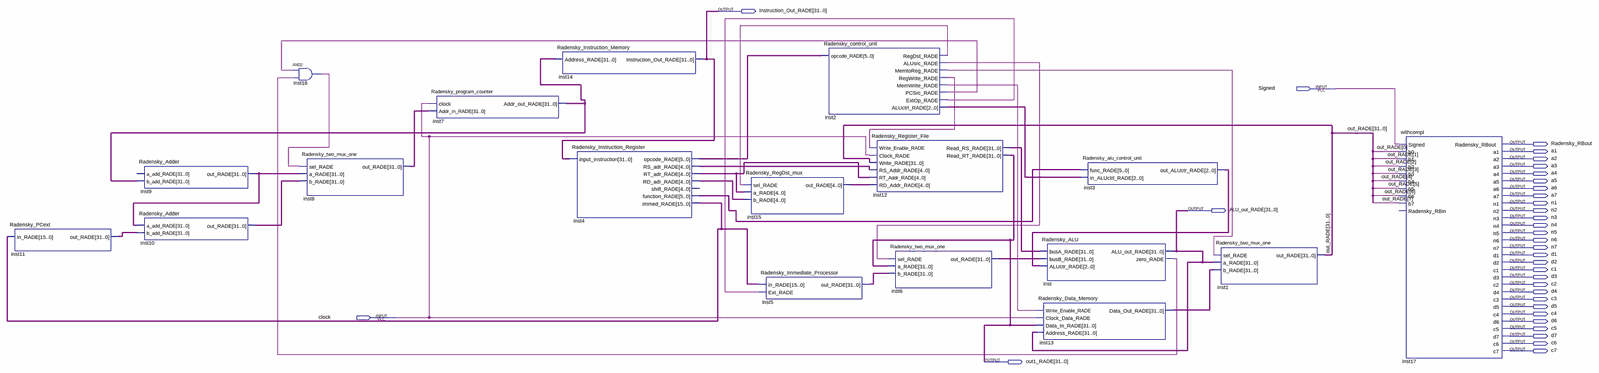
[diagram p0: schematic sheet, whole]
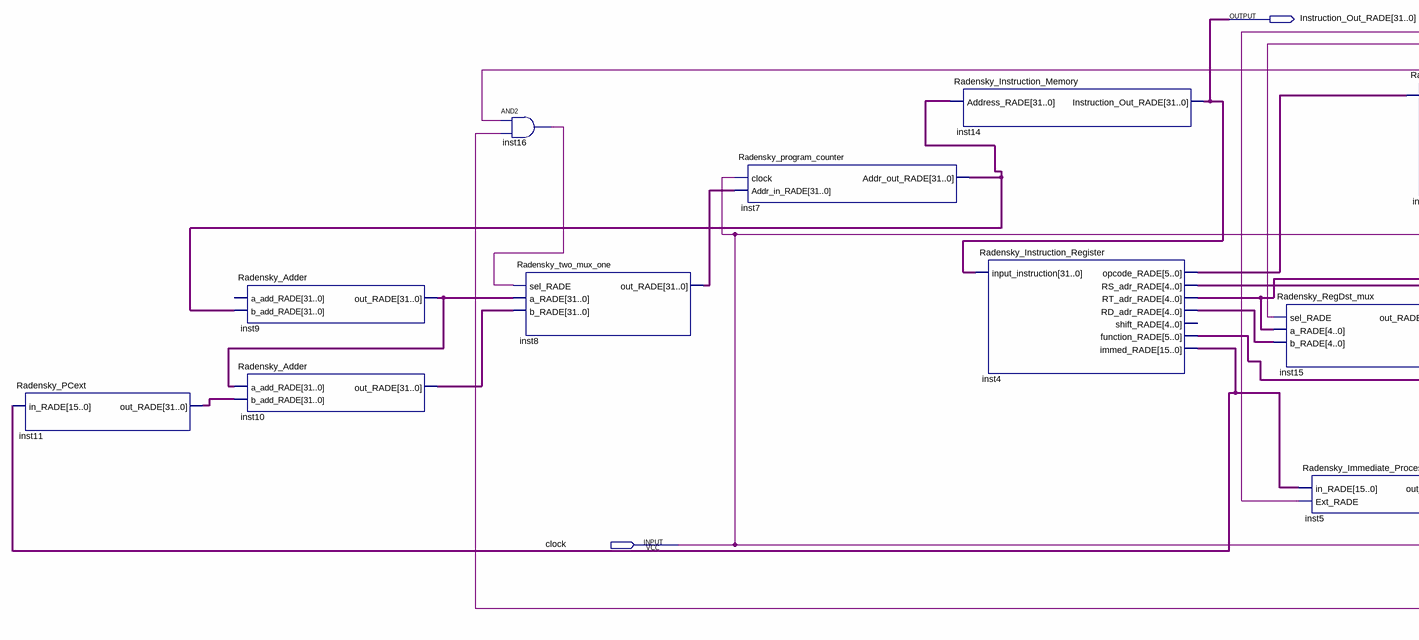
[diagram p1: schematic sheet, left part]
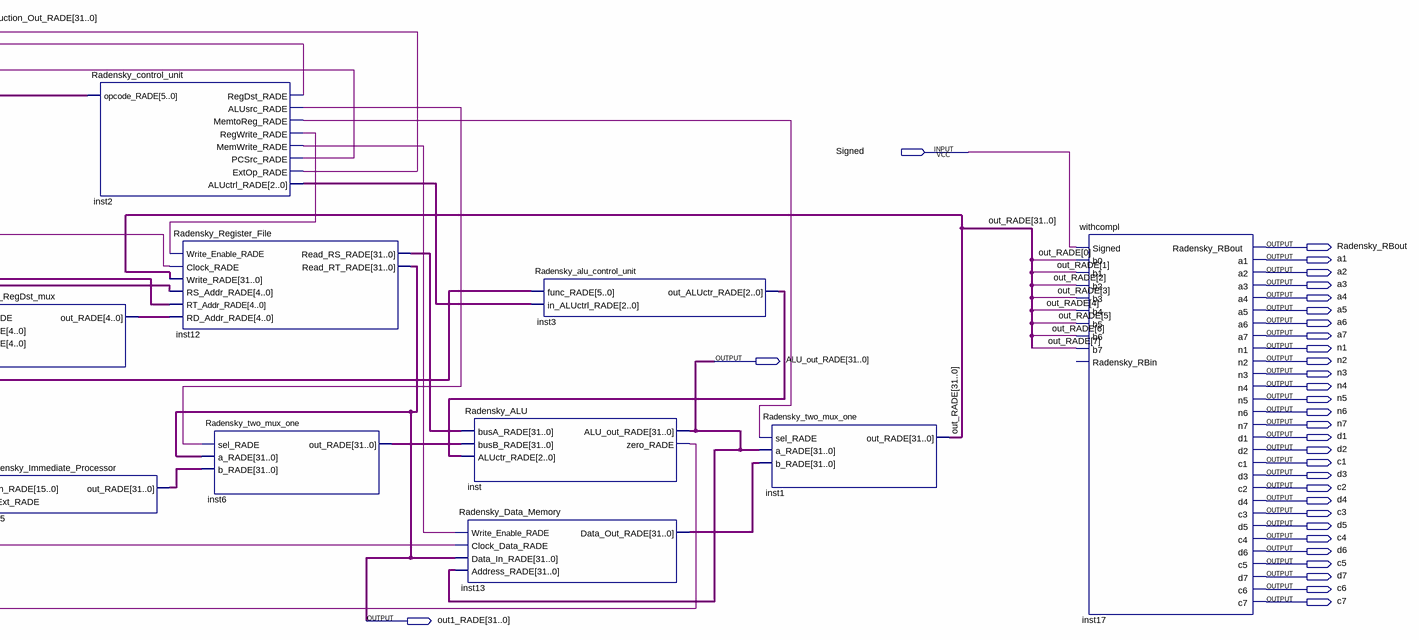
[diagram p2: schematic sheet, right part]
// Quartus schematic Radensky_Single_Cycle_CPU.bdf as structural Verilog: 18 symbols, 34 pins
module Radensky_Single_Cycle_CPU (
  input  Signed,
  input  clock,
  output [31:0] Instruction_Out_RADE,
  output Radensky_RBout,
  output a1,
  output a2,
  output a3,
  output a4,
  output a5,
  output a6,
  output a7,
  output n1,
  output [31:0] ALU_out_RADE,
  output n2,
  output n3,
  output n4,
  output n5,
  output n6,
  output n7,
  output d1,
  output d2,
  output c1,
  output d3,
  output c2,
  output d4,
  output c3,
  output d5,
  output c4,
  output d6,
  output c5,
  output d7,
  output c6,
  output c7,
  output [31:0] out1_RADE
);

  wire inst2_alusrc_rade, inst2_extop_rade, inst2_memtoreg_rade, inst2_memwrite_rade, inst2_pcsrc_rade,
       inst2_regdst_rade, inst2_regwrite_rade, inst16_out, inst_zero_rade;
  wire [2:0] inst2_aluctrl_rade, inst3_out_aluctr_rade;
  wire [4:0] inst4_rd_adr_rade, inst4_rs_adr_rade, inst4_rt_adr_rade, inst15_out_rade;
  wire [5:0] inst4_function_rade, inst4_opcode_rade;
  wire [15:0] inst4_immed_rade;
  wire [31:0] inst5_out_rade, inst6_out_rade, inst7_addr_out_rade, inst8_out_rade, inst9_out_rade,
       inst10_out_rade, inst11_out_rade, inst12_read_rs_rade, inst13_data_out_rade, out_RADE;

  Radensky_PCext inst11 (.in_RADE(inst4_immed_rade), .out_RADE(inst11_out_rade));
  Radensky_Adder inst9 (.b_add_RADE(inst7_addr_out_rade), .out_RADE(inst9_out_rade));  // open: a_add_RADE
  Radensky_Adder inst10 (.a_add_RADE(inst9_out_rade), .b_add_RADE(inst11_out_rade), .out_RADE(inst10_out_rade));
  and inst16 (inst16_out, inst2_pcsrc_rade, inst_zero_rade);
  Radensky_two_mux_one inst8 (
    .sel_RADE(inst16_out), .a_RADE(inst9_out_rade), .b_RADE(inst10_out_rade), .out_RADE(inst8_out_rade));
  Radensky_program_counter inst7 (.clock(clock), .Addr_in_RADE(inst8_out_rade), .Addr_out_RADE(inst7_addr_out_rade));
  Radensky_Instruction_Memory inst14 (.Address_RADE(inst7_addr_out_rade), .Instruction_Out_RADE(Instruction_Out_RADE));
  Radensky_Instruction_Register inst4 (
    .input_instruction(Instruction_Out_RADE), .opcode_RADE(inst4_opcode_rade),
    .RS_adr_RADE(inst4_rs_adr_rade), .RT_adr_RADE(inst4_rt_adr_rade), .RD_adr_RADE(inst4_rd_adr_rade),
    .function_RADE(inst4_function_rade), .immed_RADE(inst4_immed_rade));  // open: shift_RADE
  Radensky_RegDst_mux inst15 (
    .sel_RADE(inst2_regdst_rade), .a_RADE(inst4_rt_adr_rade), .b_RADE(inst4_rd_adr_rade),
    .out_RADE(inst15_out_rade));
  Radensky_Immediate_Processor inst5 (
    .in_RADE(inst4_immed_rade), .Ext_RADE(inst2_extop_rade), .out_RADE(inst5_out_rade));
  Radensky_control_unit inst2 (
    .opcode_RADE(inst4_opcode_rade), .RegDst_RADE(inst2_regdst_rade), .ALUsrc_RADE(inst2_alusrc_rade),
    .MemtoReg_RADE(inst2_memtoreg_rade), .RegWrite_RADE(inst2_regwrite_rade),
    .MemWrite_RADE(inst2_memwrite_rade), .PCSrc_RADE(inst2_pcsrc_rade), .ExtOp_RADE(inst2_extop_rade),
    .ALUctrl_RADE(inst2_aluctrl_rade));
  Radensky_Register_File inst12 (
    .Write_Enable_RADE(inst2_regwrite_rade), .Clock_RADE(clock), .Write_RADE(out_RADE),
    .RS_Addr_RADE(inst4_rs_adr_rade), .RT_Addr_RADE(inst4_rt_adr_rade), .RD_Addr_RADE(inst15_out_rade),
    .Read_RS_RADE(inst12_read_rs_rade), .Read_RT_RADE(out1_RADE));
  Radensky_two_mux_one inst6 (
    .sel_RADE(inst2_alusrc_rade), .a_RADE(out1_RADE), .b_RADE(inst5_out_rade), .out_RADE(inst6_out_rade));
  Radensky_Data_Memory inst13 (
    .Write_Enable_RADE(inst2_memwrite_rade), .Clock_Data_RADE(clock), .Data_In_RADE(out1_RADE),
    .Address_RADE(ALU_out_RADE), .Data_Out_RADE(inst13_data_out_rade));
  Radensky_ALU inst (
    .busA_RADE(inst12_read_rs_rade), .busB_RADE(inst6_out_rade), .ALUctr_RADE(inst3_out_aluctr_rade),
    .ALU_out_RADE(ALU_out_RADE), .zero_RADE(inst_zero_rade));
  Radensky_alu_control_unit inst3 (
    .func_RADE(inst4_function_rade), .in_ALUctrl_RADE(inst2_aluctrl_rade),
    .out_ALUctr_RADE(inst3_out_aluctr_rade));
  Radensky_two_mux_one inst1 (
    .sel_RADE(inst2_memtoreg_rade), .a_RADE(ALU_out_RADE), .b_RADE(inst13_data_out_rade), .out_RADE(out_RADE));
  withcompl inst17 (
    .Signed(Signed), .b0(out_RADE[0]), .b1(out_RADE[1]), .b2(out_RADE[2]), .b3(out_RADE[3]),
    .b4(out_RADE[4]), .b5(out_RADE[5]), .b6(out_RADE[6]), .b7(out_RADE[7]), .Radensky_RBout(Radensky_RBout),
    .a1(a1), .a2(a2), .a3(a3), .a4(a4), .a5(a5), .a6(a6), .a7(a7), .n1(n1), .n2(n2), .n3(n3), .n4(n4),
    .n5(n5), .n6(n6), .n7(n7), .d1(d1), .d2(d2), .c1(c1), .d3(d3), .c2(c2), .d4(d4), .c3(c3), .d5(d5),
    .c4(c4), .d6(d6), .c5(c5), .d7(d7), .c6(c6), .c7(c7));  // open: Radensky_RBin
endmodule
